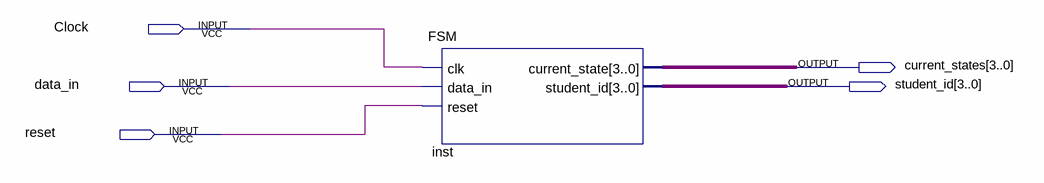
[diagram p0: schematic sheet]
// Quartus schematic FSMblock.bdf as structural Verilog: 1 symbols, 5 pins
module FSMblock (
  input  Clock,
  input  data_in,
  input  reset,
  output [3:0] current_states,
  output [3:0] student_id
);

  FSM inst (.clk(Clock), .data_in(data_in), .reset(reset), .current_state(current_states), .student_id(student_id));
endmodule
